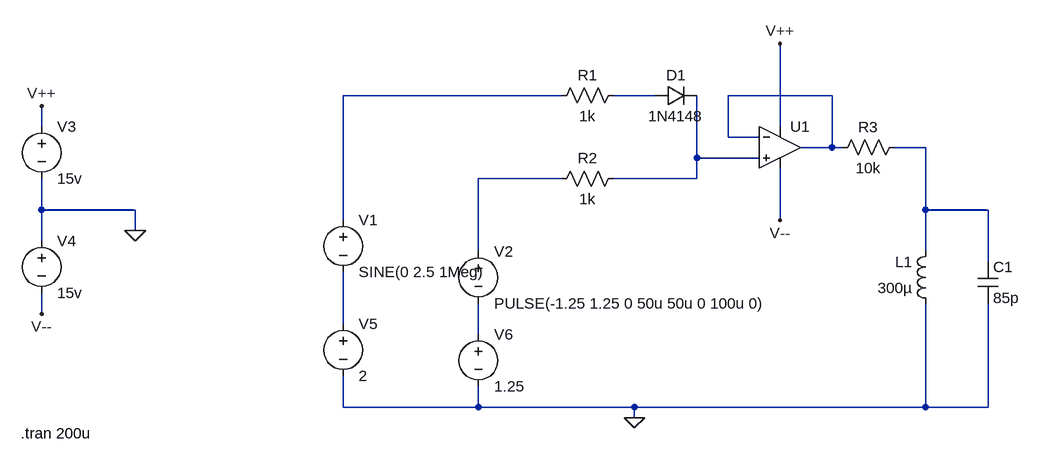
[diagram p0: schematic step2.asc]
step2.asc, the LTspice schematic file:
Version 4
SHEET 1 880 1252
WIRE 16 80 -320 80
WIRE 160 80 96 80
WIRE 432 80 272 80
WIRE -784 128 -784 96
WIRE 352 128 352 0
WIRE 272 144 272 80
WIRE 320 144 272 144
WIRE 432 160 432 80
WIRE 432 160 384 160
WIRE 448 160 432 160
WIRE 576 160 528 160
WIRE 224 176 224 80
WIRE 320 176 224 176
WIRE 16 208 -112 208
WIRE 224 208 224 176
WIRE 224 208 96 208
WIRE -784 256 -784 208
WIRE -640 256 -784 256
WIRE 576 256 576 160
WIRE 672 256 576 256
WIRE -320 272 -320 80
WIRE 352 272 352 192
WIRE -640 288 -640 256
WIRE -784 304 -784 256
WIRE -112 320 -112 208
WIRE 576 320 576 256
WIRE 672 336 672 256
WIRE -784 416 -784 384
WIRE -320 432 -320 352
WIRE -112 448 -112 400
WIRE -320 560 -320 512
WIRE -112 560 -112 528
WIRE -112 560 -320 560
WIRE 128 560 -112 560
WIRE 576 560 576 400
WIRE 576 560 128 560
WIRE 672 560 672 400
WIRE 672 560 576 560
WIRE 128 576 128 560
FLAG 128 576 0
FLAG -640 288 0
FLAG -784 96 V++
FLAG 352 0 V++
FLAG -784 416 V--
FLAG 352 272 V--
SYMBOL diode 160 96 R270
WINDOW 0 32 32 VTop 2
WINDOW 3 0 32 VBottom 2
SYMATTR InstName D1
SYMATTR Value 1N4148
SYMBOL res 112 64 R90
WINDOW 0 0 56 VBottom 2
WINDOW 3 32 56 VTop 2
SYMATTR InstName R1
SYMATTR Value 1k
SYMBOL res 112 192 R90
WINDOW 0 0 56 VBottom 2
WINDOW 3 32 56 VTop 2
SYMATTR InstName R2
SYMATTR Value 1k
SYMBOL OpAmps\\UniversalOpAmp2 352 160 R0
SYMATTR InstName U1
SYMBOL res 544 144 R90
WINDOW 0 0 56 VBottom 2
WINDOW 3 32 56 VTop 2
SYMATTR InstName R3
SYMATTR Value 10k
SYMBOL ind 592 416 R180
WINDOW 0 36 80 Left 2
WINDOW 3 36 40 Left 2
SYMATTR InstName L1
SYMATTR Value 300µ
SYMBOL cap 656 336 R0
SYMATTR InstName C1
SYMATTR Value 85p
SYMBOL voltage -320 256 R0
WINDOW 123 0 0 Left 0
WINDOW 39 0 0 Left 0
SYMATTR InstName V1
SYMATTR Value SINE(0 2.5 1Meg)
SYMBOL voltage -112 304 R0
WINDOW 123 0 0 Left 0
WINDOW 39 0 0 Left 0
SYMATTR InstName V2
SYMATTR Value PULSE(-1.25 1.25 0 50u 50u 0 100u 0)
SYMBOL voltage -784 112 R0
WINDOW 123 0 0 Left 0
WINDOW 39 0 0 Left 0
SYMATTR InstName V3
SYMATTR Value 15v
SYMBOL voltage -784 288 R0
WINDOW 123 0 0 Left 0
WINDOW 39 0 0 Left 0
SYMATTR InstName V4
SYMATTR Value 15v
SYMBOL voltage -320 416 R0
WINDOW 123 0 0 Left 0
WINDOW 39 0 0 Left 0
SYMATTR InstName V5
SYMATTR Value 2
SYMBOL voltage -112 432 R0
WINDOW 123 0 0 Left 0
WINDOW 39 0 0 Left 0
SYMATTR InstName V6
SYMATTR Value 1.25
TEXT -816 600 Left 2 !.tran 200u

The netlist it stands for:
* step2.asc
D1 N002 N005 1N4148
R1 N002 N001 1k
R2 N005 N006 1k
XU1 N005 N003 V++ V-- N003 level2 Avol=1Meg GBW=10Meg Slew=10Meg Ilimit=25m Rail=0 Vos=0 En=0 Enk=0 In=0 Ink=0 Rin=500Meg  ; pins In+ In- V+ V- OUT
R3 N004 N003 10k
L1 0 N004 300µ
C1 N004 0 85p
V1 N001 N007 SINE(0 2.5 1Meg)
V2 N006 N008 PULSE(-1.25 1.25 0 50u 50u 0 100u 0)
V3 V++ 0 15v
V4 0 V-- 15v
V5 N007 0 2
V6 N008 0 1.25
.model D D
.lib standard.dio
.tran 200u
.lib UniversalOpAmp2.lib
.backanno
.end